# Altium schematic sheet Sheet1.SchDoc: Module cảm biến IR
size A4
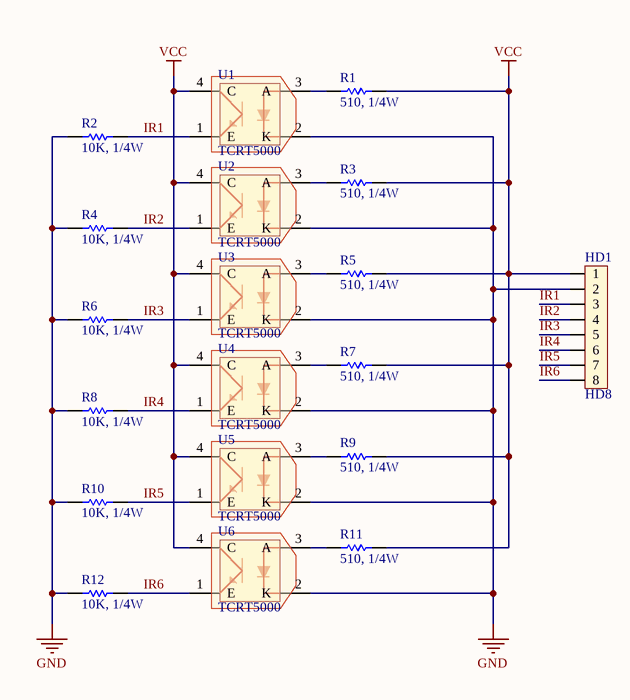
[diagram p0: Sheet1.SchDoc]

## Parts
HD1  HD8  [Header_8]
R1  value 510, 1/4W  [CFR25S]  (hidden comment: CF1/4W1KJ25)
R2  value 10K, 1/4W  [CFR25S]  (hidden comment: CF1/4W1KJ25)
R3  value 510, 1/4W  [CFR25S]  (hidden comment: CF1/4W1KJ25)
R4  value 10K, 1/4W  [CFR25S]  (hidden comment: CF1/4W1KJ25)
R5  value 510, 1/4W  [CFR25S]  (hidden comment: CF1/4W1KJ25)
R6  value 10K, 1/4W  [CFR25S]  (hidden comment: CF1/4W1KJ25)
R7  value 510, 1/4W  [CFR25S]  (hidden comment: CF1/4W1KJ25)
R8  value 10K, 1/4W  [CFR25S]  (hidden comment: CF1/4W1KJ25)
R9  value 510, 1/4W  [CFR25S]  (hidden comment: CF1/4W1KJ25)
R10  value 10K, 1/4W  [CFR25S]  (hidden comment: CF1/4W1KJ25)
R11  value 510, 1/4W  [CFR25S]  (hidden comment: CF1/4W1KJ25)
R12  value 10K, 1/4W  [CFR25S]  (hidden comment: CF1/4W1KJ25)
U1  TCRT5000  [TCRT5000]
U2  TCRT5000  [TCRT5000]
U3  TCRT5000  [TCRT5000]
U4  TCRT5000  [TCRT5000]
U5  TCRT5000  [TCRT5000]
U6  TCRT5000  [TCRT5000]

## Nets
GND: HD1.2 R2.1 R4.1 R6.1 R8.1 R10.1 R12.1 U1.2(K) U2.2(K) U3.2(K) U4.2(K) U5.2(K) U6.2(K)
VCC: HD1.1 R1.2 R3.2 R5.2 R7.2 R9.2 R11.2 U1.4(C) U2.4(C) U3.4(C) U4.4(C) U5.4(C) U6.4(C)
IR1: HD1.3 R2.2 U1.1(E)
IR2: HD1.4 R4.2 U2.1(E)
IR3: HD1.5 R6.2 U3.1(E)
IR4: HD1.6 R8.2 U4.1(E)
IR5: HD1.7 R10.2 U5.1(E)
IR6: HD1.8 R12.2 U6.1(E)
NetR1_1: R1.1 U1.3(A)
NetR3_1: R3.1 U2.3(A)
NetR5_1: R5.1 U3.3(A)
NetR7_1: R7.1 U4.3(A)
NetR9_1: R9.1 U5.3(A)
NetR11_1: R11.1 U6.3(A)

## Notes on the sheet
- Title
- Size:
- Date:
- A4
- Number:
- Time:
- Revision:
- Sheet
- of
- File:

## Library data of the parts
HD1 = Header8: Header 8; Creat by: VanDungEvn@Gmail.com
R1 R3 R5 R7 R9 R11 = CF1/4W1KJ25: RES CF AXIAL-0.3 5% 1/4W 1K; Unit Price: 0.001; ComponentLink1Description: Datasheet; ComponentLink1URL: D:\Dropbox\Datasheets\Passive Components\Resistors\Carbon Film Resistor.pdf
R2 R4 R6 R8 R10 R12 = CF1/4W1KJ25: RES CF AXIAL-0.3 5% 1/4W 10K; Unit Price: 0.001; ComponentLink1Description: Datasheet; ComponentLink1URL: D:\Dropbox\Datasheets\Passive Components\Resistors\Carbon Film Resistor.pdf
U1-U6 = TCRT5000: IR sensor